# Altium schematic sheet BME280_I2C.SchDoc
size A4
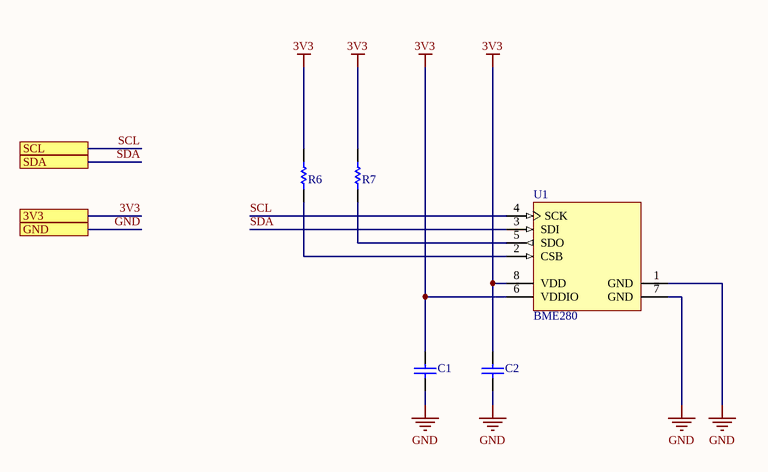
[diagram p0: BME280_I2C.SchDoc]

## Parts
C1  C0805C104J5RAC7800  [CAPC2013X145X50NL20T25]  (value not drawn)
C2  C0805C104J5RAC7800  [CAPC2013X145X50NL20T25]  (value not drawn)
R6  RC0805JR-074K7L  [RESC2013X60X30NL20T20]  (value not drawn)
R7  RC0805JR-074K7L  [RESC2013X60X30NL20T20]  (value not drawn)
U1  BME280  [BOSC-BME280-8_V]

## Ports
3V3, GND, SCL, SDA

## Nets
3V3: C1.2 C2.2 R6.2 R7.2 U1.6(VDDIO) U1.8(VDD) ; port 3V3
GND: C1.1 C2.1 U1.1(GND) U1.7(GND) ; port GND
SCL: U1.4(SCK) ; port SCL
SDA: U1.3(SDI) ; port SDA
NetR6_1: R6.1 U1.2(CSB)
NetR7_1: R7.1 U1.5(SDO)

## Library data of the parts
C1 C2 = CMP-2007-01102-1: 0.1µF ±5% 50V Ceramic Capacitor X7R 0805 (2012 Metric); Manufacturer: Kemet; Part Number: C0805C104J5RAC7800
R6 R7 = RC0805JR-074K7L: 4.7 kOhms ±5% 0.125W, 1/8W Chip Resistor 0805 (2012 Metric) Moisture Resistant Thick Film; Manufacturer: Yageo; Part Number: RC0805JR-074K7L
U1 = CMP-2000-05073-1: Combined Humidity and Pressure Sensor, 1.71 to 3.6 V, -40 to 85 degC, 8-Pin SMD, RoHS, Tape and Reel; Manufacturer: Bosch Sensortec; Datasheet Version: Rev. 1.2, 10/2015; Datasheet URL: http://datasheet.octopart.com/BME280-Bosch-datasheet-58577763.pdf; Manufacturer URL: http://www.bosch-sensortec.com; ComponentLink1Description: BME280; ComponentLink1URL: https://co.mouser.com/ProductDetail/Bosch-Sensortec/BME280?qs=sGAEpiMZZMsF1ODjcwEocB0teEbUEBlMe2ty%252bXJvNLw%3d